# EAGLE design IVSTAGEV3 (EAGLE 5.07)
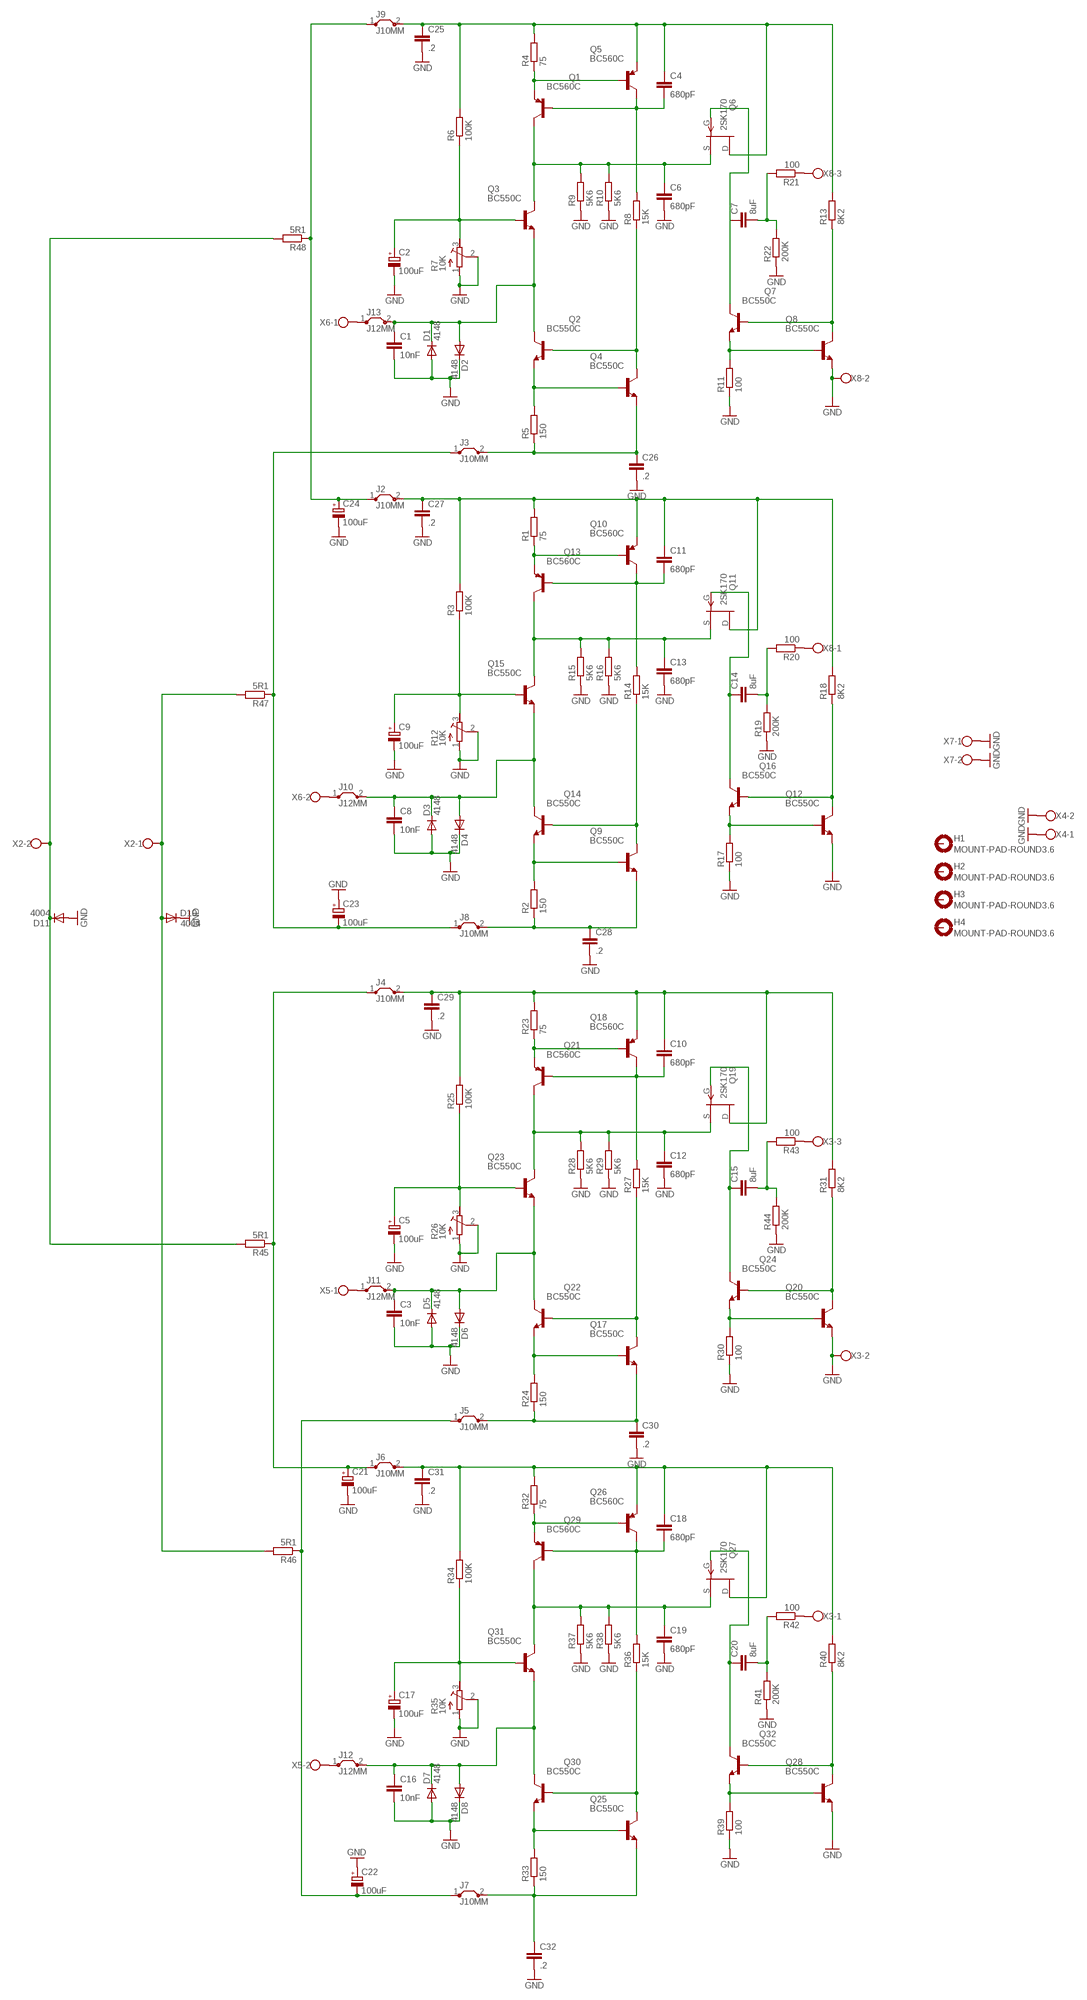
[diagram p0: schematic, sheet 1]

## Parts
C1  10nF  C-EU050-055X075  [C050-055X075]
C2  100uF  CPOL-EUE5-10.5  [E5-10,5]
C3  10nF  C-EU050-055X075  [C050-055X075]
C4  680pF  C-EU050-055X075  [C050-055X075]
C5  100uF  CPOL-EUE5-10.5  [E5-10,5]
C6  680pF  C-EU050-055X075  [C050-055X075]
C7  8uF  C-EU275-173X316  [C275-173X316]
C8  10nF  C-EU050-055X075  [C050-055X075]
C9  100uF  CPOL-EUE5-10.5  [E5-10,5]
C10  680pF  C-EU050-055X075  [C050-055X075]
C11  680pF  C-EU050-055X075  [C050-055X075]
C12  680pF  C-EU050-055X075  [C050-055X075]
C13  680pF  C-EU050-055X075  [C050-055X075]
C14  8uF  C-EU275-173X316  [C275-173X316]
C15  8uF  C-EU275-173X316  [C275-173X316]
C16  10nF  C-EU050-055X075  [C050-055X075]
C17  100uF  CPOL-EUE5-10.5  [E5-10,5]
C18  680pF  C-EU050-055X075  [C050-055X075]
C19  680pF  C-EU050-055X075  [C050-055X075]
C20  8uF  C-EU275-173X316  [C275-173X316]
C21  100uF  CPOL-EUE5-10.5  [E5-10,5]
C22  100uF  CPOL-EUE5-10.5  [E5-10,5]
C23  100uF  CPOL-EUE5-10.5  [E5-10,5]
C24  100uF  CPOL-EUE5-10.5  [E5-10,5]
C25  .2  C-EUC1210K  [C1210K]
C26  .2  C-EUC1210K  [C1210K]
C27  .2  C-EUC1210K  [C1210K]
C28  .2  C-EUC1210K  [C1210K]
C29  .2  C-EUC1210K  [C1210K]
C30  .2  C-EUC1210K  [C1210K]
C31  .2  C-EUC1210K  [C1210K]
C32  .2  C-EUC1210K  [C1210K]
D1  4148  1N4148DO35-7  [DO35-7]
D2  4148  1N4148DO35-7  [DO35-7]
D3  4148  1N4148DO35-7  [DO35-7]
D4  4148  1N4148DO35-7  [DO35-7]
D5  4148  1N4148DO35-7  [DO35-7]
D6  4148  1N4148DO35-7  [DO35-7]
D7  4148  1N4148DO35-7  [DO35-7]
D8  4148  1N4148DO35-7  [DO35-7]
D10  4004  1N4148DO35-7  [DO35-7]
D11  4004  1N4148DO35-7  [DO35-7]
H1  MOUNT-PAD-ROUND3.6  [3,6-PAD]
H2  MOUNT-PAD-ROUND3.6  [3,6-PAD]
H3  MOUNT-PAD-ROUND3.6  [3,6-PAD]
H4  MOUNT-PAD-ROUND3.6  [3,6-PAD]
J2  J10MM  [10]
J3  J10MM  [10]
J4  J10MM  [10]
J5  J10MM  [10]
J6  J10MM  [10]
J7  J10MM  [10]
J8  J10MM  [10]
J9  J10MM  [10]
J10  J12MM  [12]
J11  J12MM  [12]
J12  J12MM  [12]
J13  J12MM  [12]
Q1  BC560C  BC556  [TO92-EBC]
Q2  BC550C  BC546A  [TO92-EBC]
Q3  BC550C  BC546A  [TO92-EBC]
Q4  BC550C  BC546A  [TO92-EBC]
Q5  BC560C  BC556  [TO92-EBC]
Q6  2SK170  2N5484  [TO92-]
Q7  BC550C  BC546A  [TO92-EBC]
Q8  BC550C  BC546A  [TO92-EBC]
Q9  BC550C  BC546A  [TO92-EBC]
Q10  BC560C  BC556  [TO92-EBC]
Q11  2SK170  2N5484  [TO92-]
Q12  BC550C  BC546A  [TO92-EBC]
Q13  BC560C  BC556  [TO92-EBC]
Q14  BC550C  BC546A  [TO92-EBC]
Q15  BC550C  BC546A  [TO92-EBC]
Q16  BC550C  BC546A  [TO92-EBC]
Q17  BC550C  BC546A  [TO92-EBC]
Q18  BC560C  BC556  [TO92-EBC]
Q19  2SK170  2N5484  [TO92-]
Q20  BC550C  BC546A  [TO92-EBC]
Q21  BC560C  BC556  [TO92-EBC]
Q22  BC550C  BC546A  [TO92-EBC]
Q23  BC550C  BC546A  [TO92-EBC]
Q24  BC550C  BC546A  [TO92-EBC]
Q25  BC550C  BC546A  [TO92-EBC]
Q26  BC560C  BC556  [TO92-EBC]
Q27  2SK170  2N5484  [TO92-]
Q28  BC550C  BC546A  [TO92-EBC]
Q29  BC560C  BC556  [TO92-EBC]
Q30  BC550C  BC546A  [TO92-EBC]
Q31  BC550C  BC546A  [TO92-EBC]
Q32  BC550C  BC546A  [TO92-EBC]
R1  75  R-EU_0204/7  [0204/7]
R2  150  R-EU_0204/7  [0204/7]
R3  100K  R-EU_0204/7  [0204/7]
R4  75  R-EU_0204/7  [0204/7]
R5  150  R-EU_0204/7  [0204/7]
R6  100K  R-EU_0204/7  [0204/7]
R7  10K  R-TRIMM3296W  [RTRIM3296W]
R8  15K  R-EU_0309/12  [0309/12]
R9  5K6  R-EU_0207/10  [0207/10]
R10  5K6  R-EU_0207/10  [0207/10]
R11  100  R-EU_0204/7  [0204/7]
R12  10K  R-TRIMM3296W  [RTRIM3296W]
R13  8K2  R-EU_0309/12  [0309/12]
R14  15K  R-EU_0309/12  [0309/12]
R15  5K6  R-EU_0207/10  [0207/10]
R16  5K6  R-EU_0207/10  [0207/10]
R17  100  R-EU_0204/7  [0204/7]
R18  8K2  R-EU_0309/12  [0309/12]
R19  200K  R-EU_0204/7  [0204/7]
R20  100  R-EU_0204/7  [0204/7]
R21  100  R-EU_0204/7  [0204/7]
R22  200K  R-EU_0204/7  [0204/7]
R23  75  R-EU_0204/7  [0204/7]
R24  150  R-EU_0204/7  [0204/7]
R25  100K  R-EU_0204/7  [0204/7]
R26  10K  R-TRIMM3296W  [RTRIM3296W]
R27  15K  R-EU_0309/12  [0309/12]
R28  5K6  R-EU_0207/10  [0207/10]
R29  5K6  R-EU_0207/10  [0207/10]
R30  100  R-EU_0204/7  [0204/7]
R31  8K2  R-EU_0309/12  [0309/12]
R32  75  R-EU_0204/7  [0204/7]
R33  150  R-EU_0204/7  [0204/7]
R34  100K  R-EU_0204/7  [0204/7]
R35  10K  R-TRIMM3296W  [RTRIM3296W]
R36  15K  R-EU_0309/12  [0309/12]
R37  5K6  R-EU_0207/10  [0207/10]
R38  5K6  R-EU_0207/10  [0207/10]
R39  100  R-EU_0204/7  [0204/7]
R40  8K2  R-EU_0309/12  [0309/12]
R41  200K  R-EU_0204/7  [0204/7]
R42  100  R-EU_0204/7  [0204/7]
R43  100  R-EU_0204/7  [0204/7]
R44  200K  R-EU_0204/7  [0204/7]
R45  5R1  R-EU_0204/7  [0204/7]
R46  5R1  R-EU_0204/7  [0204/7]
R47  5R1  R-EU_0204/7  [0204/7]
R48  5R1  R-EU_0204/7  [0204/7]
X2  W237-02P  [W237-132]
X3  W237-3E  [W237-3E]
X4  W237-02P  [W237-132]
X5  W237-02P  [W237-132]
X6  W237-02P  [W237-132]
X7  W237-02P  [W237-132]
X8  W237-3E  [W237-3E]

## Nets
GND: C1.2 C2.- C3.2 C5.- C6.2 C8.2 C9.- C12.2 C13.2 C16.2 C17.- C19.2 C21.- C22.+ C23.+ C24.- C25.2 C26.2 C27.2 C28.2 C29.2 C30.2 C31.2 C32.2 D1.A D2.C D3.A D4.C D5.A D6.C D7.A D8.C D10.C D11.A Q8.E Q12.E Q20.E Q28.E R7.1(E) R7.2(S) R9.1 R10.1 R11.1 R12.1(E) R12.2(S) R15.1 R16.1 R17.1 R19.1 R22.1 R26.1(E) R26.2(S) R28.1 R29.1 R30.1 R35.1(E) R35.2(S) R37.1 R38.1 R39.1 R41.1 R44.1 X3.2 X4.1 X4.2 X7.1 X7.2 X8.2
N$1: C6.1 Q1.C Q3.C Q6.2(S) R9.2 R10.2
N$2: C1.1 D1.C D2.A J13.2 Q2.C Q3.E
N$3: C2.+ Q3.B R6.1 R7.3(A)
N$4: C13.1 Q11.2(S) Q13.C Q15.C R15.2 R16.2
N$5: C8.1 D3.C D4.A J10.2 Q14.C Q15.E
N$6: Q1.E Q5.B R4.1
N$7: Q2.E Q4.B R5.2
N$8: Q2.B Q4.C R8.1
N$9: C4.2 Q1.B Q5.C R8.2
N$10: C26.1 J3.2 Q4.E R5.1
N$11: C4.1 C25.1 J9.2 Q5.E Q6.3(D) R4.2 R6.2 R13.2
N$12: C9.+ Q15.B R3.1 R12.3(A)
N$13: C7.1 Q6.1(G) Q7.C
N$14: Q7.E Q8.B R11.2
N$15: Q10.B Q13.E R1.1
N$16: Q7.B Q8.C R13.1
N$17: Q9.B Q14.E R2.2
N$18: Q9.C Q14.B R14.1
N$19: C11.2 Q10.C Q13.B R14.2
N$20: C28.1 J8.2 Q9.E R2.1
N$21: C11.1 C27.1 J2.2 Q10.E Q11.3(D) R1.2 R3.2 R18.2
N$22: C14.1 Q11.1(G) Q16.C
N$23: Q12.B Q16.E R17.2
N$24: Q12.C Q16.B R18.1
N$25: C14.2 R19.2 R20.2
N$26: C7.2 R21.2 R22.2
N$27: R21.1 X8.3
N$28: R20.1 X8.1
N$29: C12.1 Q19.2(S) Q21.C Q23.C R28.2 R29.2
N$30: C3.1 D5.C D6.A J11.2 Q22.C Q23.E
N$31: C5.+ Q23.B R25.1 R26.3(A)
N$32: Q18.B Q21.E R23.1
N$33: Q17.B Q22.E R24.2
N$34: Q17.C Q22.B R27.1
N$35: C10.2 Q18.C Q21.B R27.2
N$36: C30.1 J5.2 Q17.E R24.1
N$37: C10.1 C29.1 J4.2 Q18.E Q19.3(D) R23.2 R25.2 R31.2
N$38: C15.1 Q19.1(G) Q24.C
N$39: Q20.B Q24.E R30.2
N$40: Q20.C Q24.B R31.1
N$41: C19.1 Q27.2(S) Q29.C Q31.C R37.2 R38.2
N$42: C16.1 D7.C D8.A J12.2 Q30.C Q31.E
N$43: C17.+ Q31.B R34.1 R35.3(A)
N$44: Q26.B Q29.E R32.1
N$45: Q25.B Q30.E R33.2
N$46: Q25.C Q30.B R36.1
N$47: C18.2 Q26.C Q29.B R36.2
N$48: C32.1 J7.2 Q25.E R33.1
N$49: C18.1 C31.1 J6.2 Q26.E Q27.3(D) R32.2 R34.2 R40.2
N$50: C20.1 Q27.1(G) Q32.C
N$51: Q28.B Q32.E R39.2
N$52: Q28.C Q32.B R40.1
N$53: C20.2 R41.2 R42.2
N$54: C15.2 R43.2 R44.2
N$55: R43.1 X3.3
N$56: R42.1 X3.1
N$57: C24.+ J2.1 J9.1 R48.1
N$58: C23.- J3.1 J8.1 R47.1
N$59: C21.+ J4.1 J6.1 R45.1
N$60: J12.1 X5.2
N$61: J11.1 X5.1
N$62: J10.1 X6.2
N$63: J13.1 X6.1
N$64: C22.- J5.1 J7.1 R46.1
N$65: D11.C R45.2 R48.2 X2.2
N$66: D10.A R46.2 R47.2 X2.1
Unconnected: H1.B3,6(MOUNT) H2.B3,6(MOUNT) H3.B3,6(MOUNT) H4.B3,6(MOUNT)

## Library data of the parts
C1 C3 C4 C6-C8 C10-C16 C18-C20 C25-C32 = resistor:C-EU: CAPACITOR, European symbol
C2 C5 C9 C17 C21-C24 = resistor:CPOL-EU: POLARIZED CAPACITOR, European symbol
D1-D8 D10 D11 = diode:1N4148: DIODE high speed (Philips)
H1-H4 = holes:MOUNT-PAD-ROUND: MOUNTING PAD, round
J2-J13 = jumper:J: Bridge
Q1 Q5 Q10 Q13 Q18 Q21 Q26 Q29 = transistor-pnp:BC556*: PNP Transistror
Q2-Q4 Q7-Q9 Q12 Q14-Q17 Q20 Q22-Q25 Q28 Q30-Q32 = transistor-npn:BC546*: NPN Transistor
Q6 Q11 Q19 Q27 = transistor-fet:?548*: N-Channel JFETs Source: VISHAY 2N5484.pdf Compatible: TO92 2N5245 J304 J305 U310 J308 J309 J310 TO72 2N4416 2N4416A 2N3823 2N4351 3N169 3N170 3N171 MFE3002 TO18 2N3796 2N3797 MFE825 Source: Motorola European Master Guide Pacge 3-59
R1-R6 R8-R11 R13-R25 R27-R34 R36-R48 = resistor:R-EU_: RESISTOR, European symbol
R7 R12 R26 R35 = resistor:R-TRIMM: Trimm resistor
X2 X4-X7 = con-wago-508:W237-02P: WAGO SREW CLAMP
X3 X8 = con-wago-508:W237-3E: WAGO SREW CLAMP

## Board
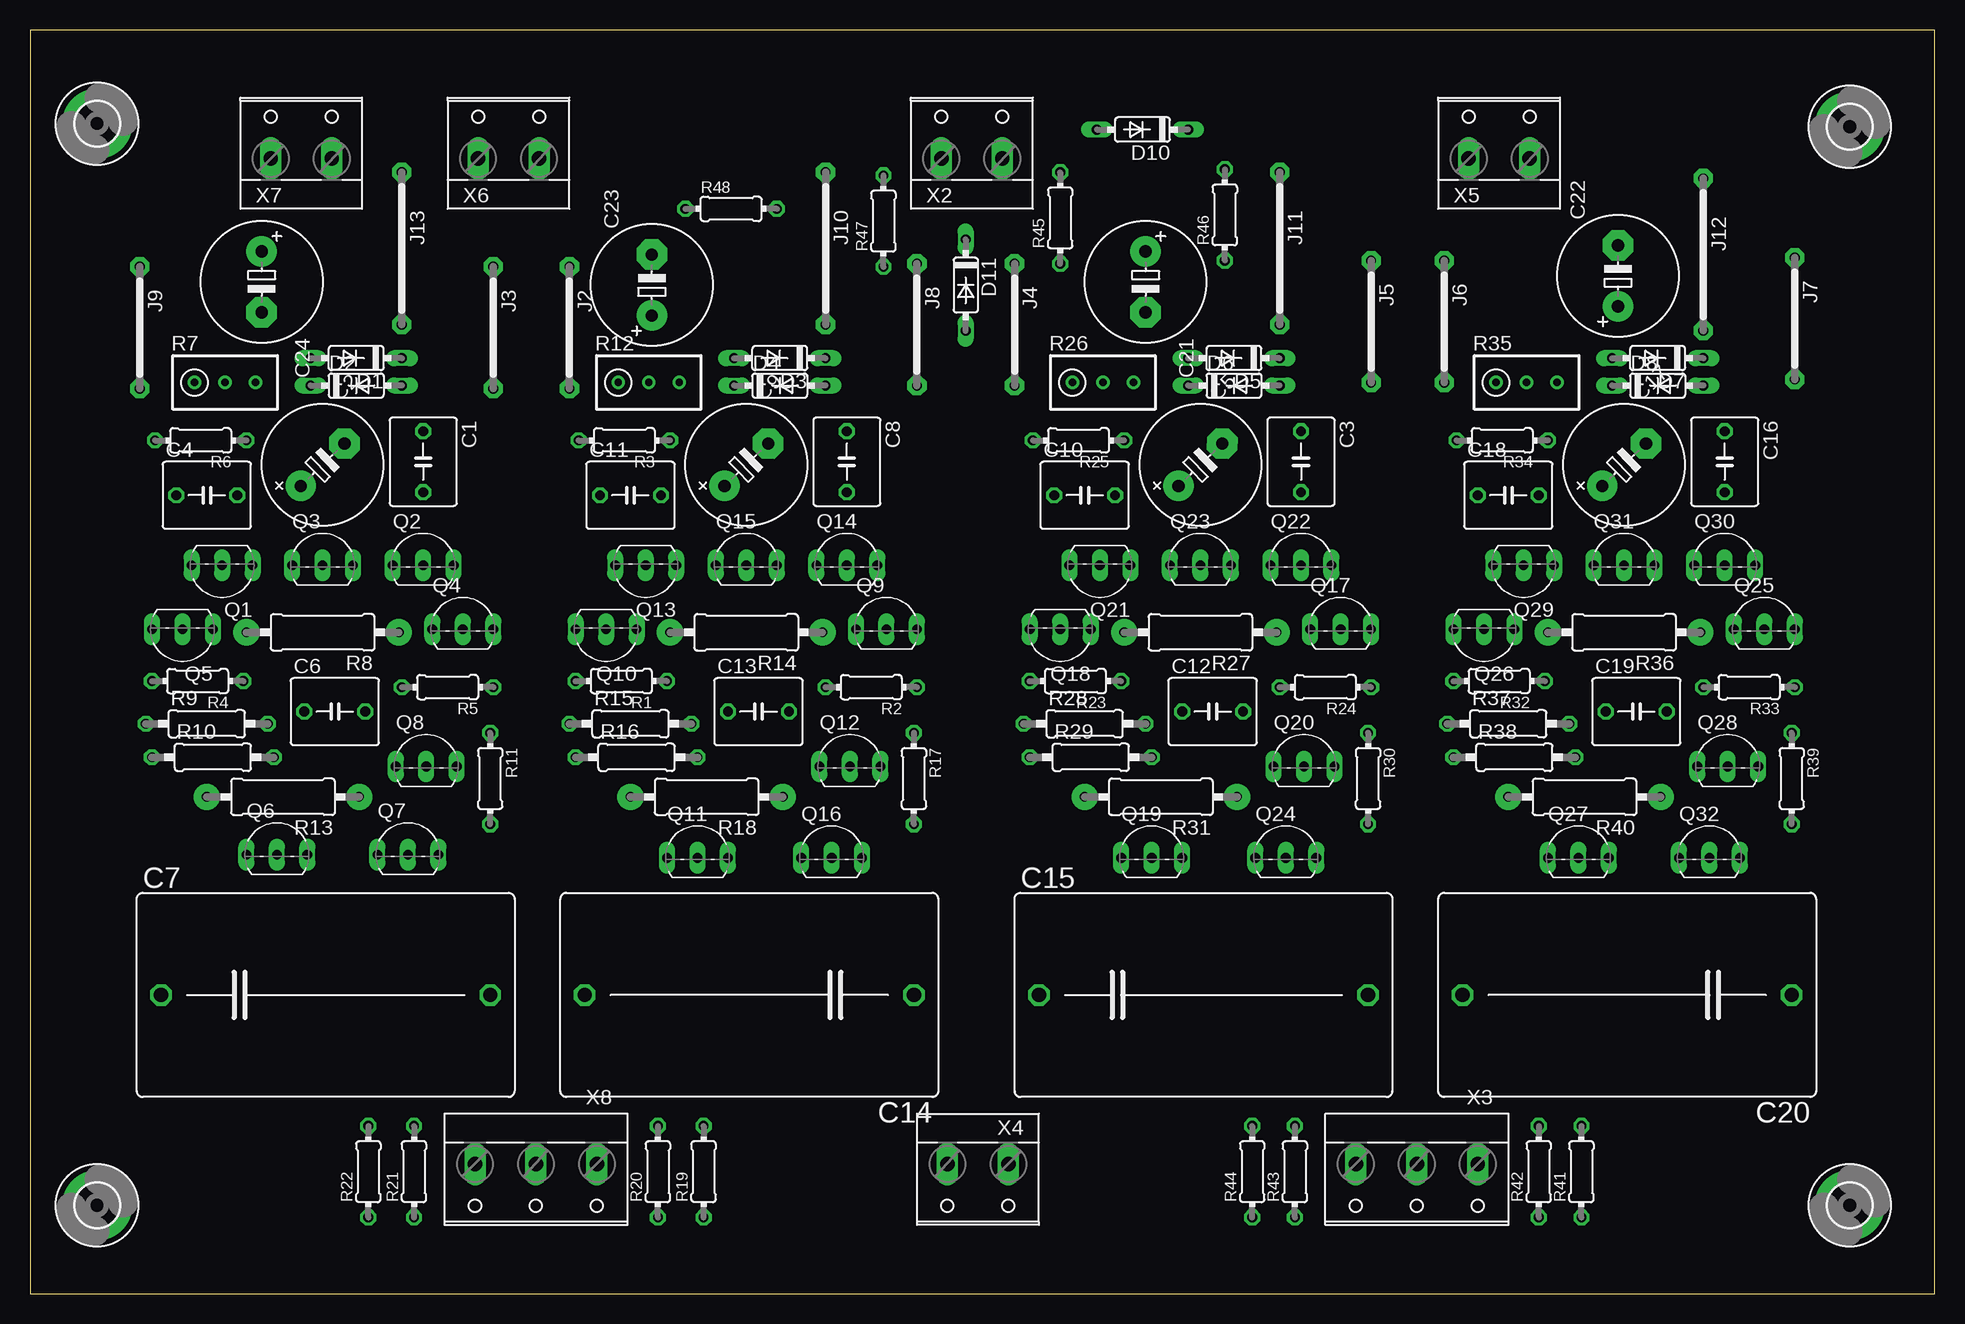
[diagram p1: board, top side]
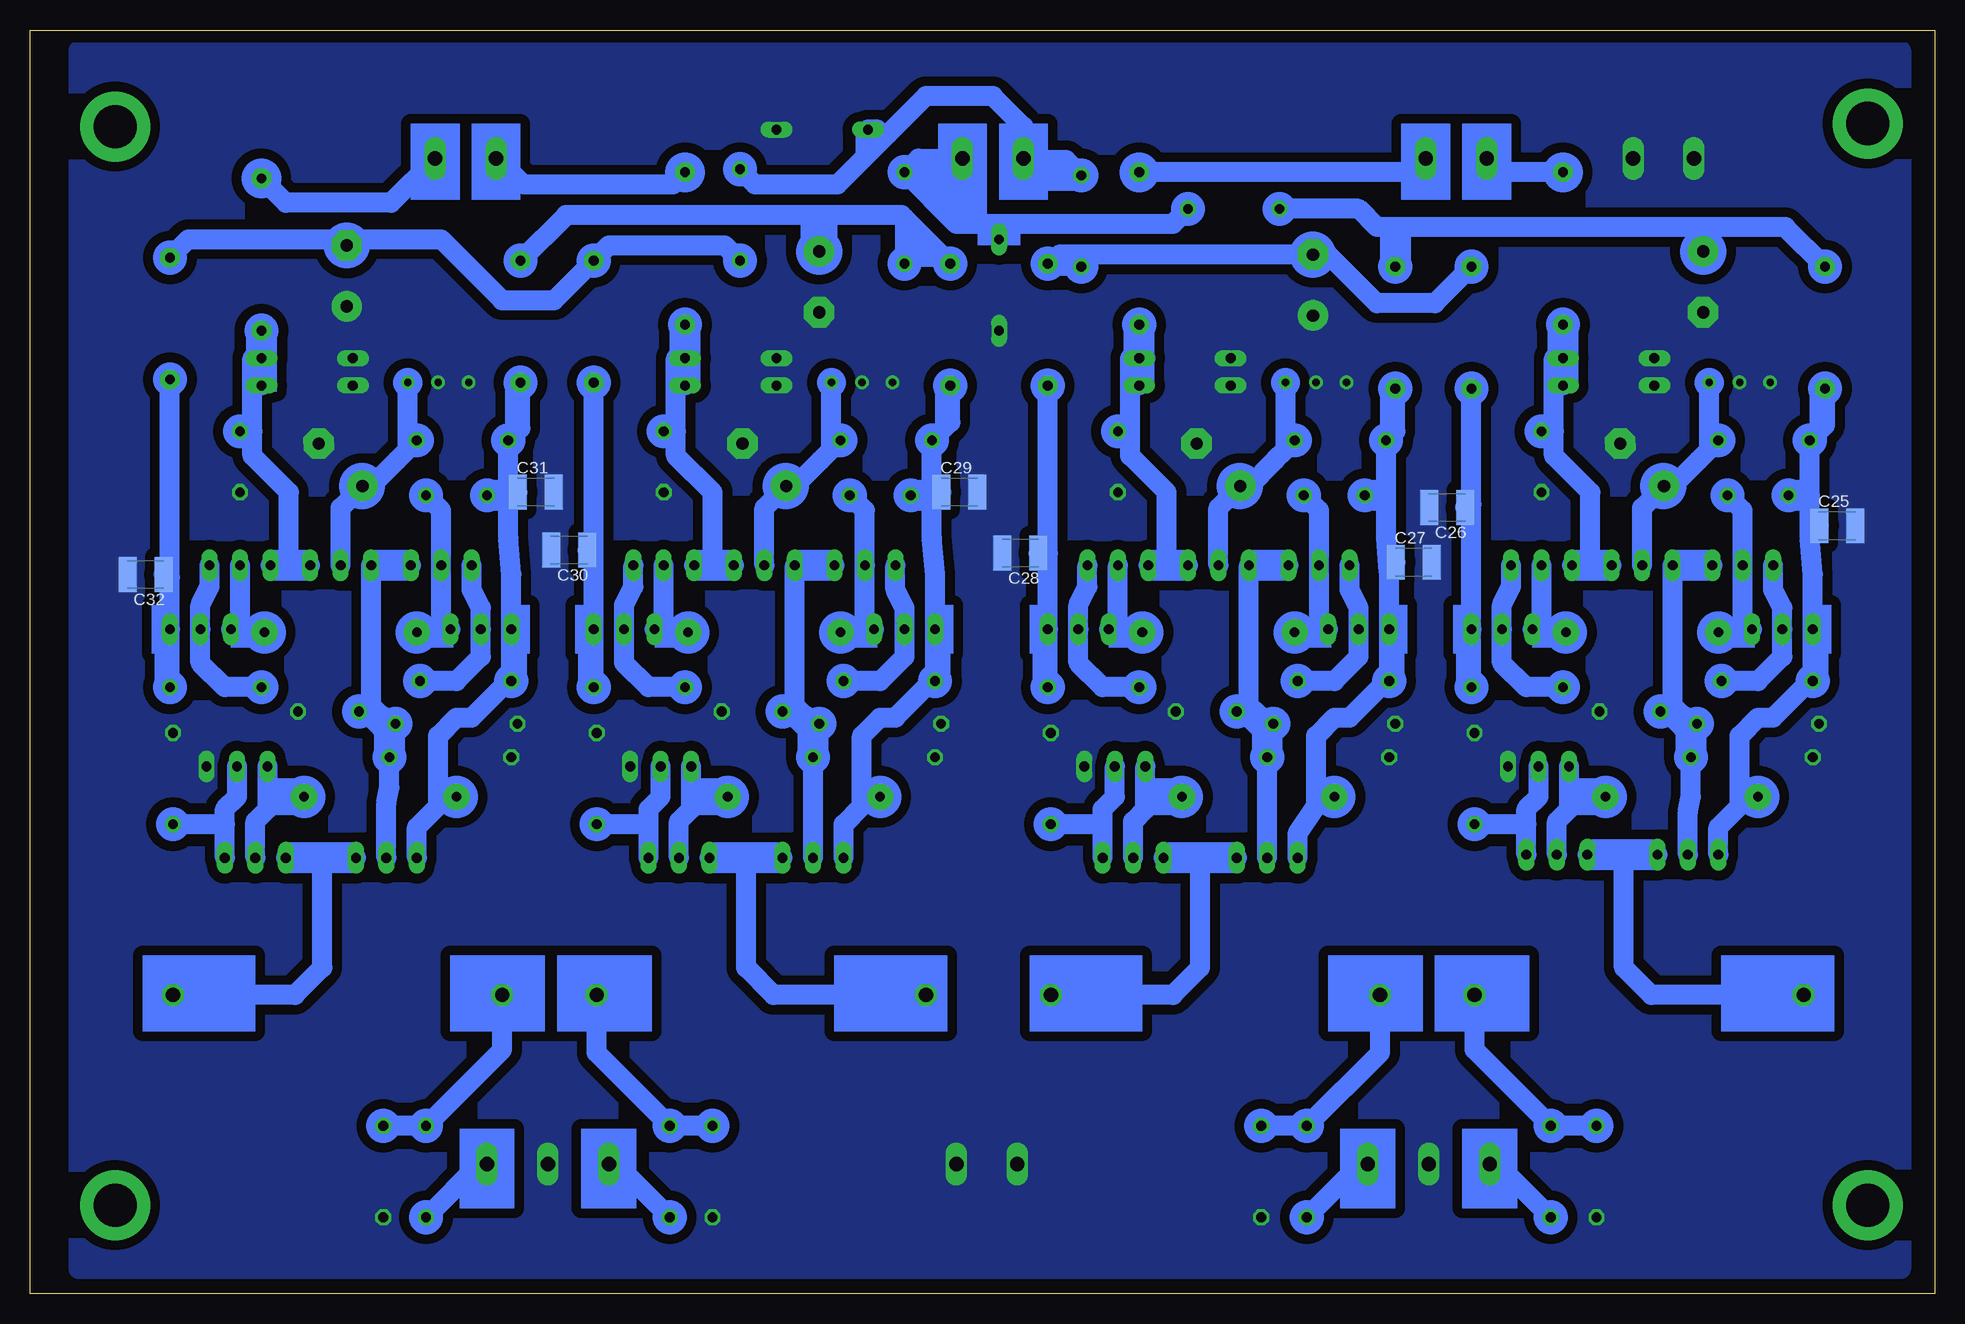
[diagram p2: board, bottom side, seen from below]

Size 158.73 x 105.33 mm. Coordinates in mm from the lower left corner, seen from the top.
Outline: 0,0 158.73,0 158.73,105.33 0,105.33 0,0
Copper layers (1*16): Top 0.035mm / dielectric 1.5mm / Bottom 0.035mm
Design rules "default *": minimum track width 10mil, minimum drill 24mil, track to track 8mil, track to pad 8mil, pad to pad 8mil, via to via 8mil, smd to smd 8mil, copper to edge 40mil, drill to drill 8mil, minimum pad ring 10mil, minimum via ring 8mil, stop-mask expansion 4mil, vias tented up to drill 0mil, thermal gap 10mil

### Footprints (pad centres in the part's own frame; a part is rotated, then mirrored left to right if it is on the bottom)
C050-055X075 = drill 0.813 octagon: 1 -2.54,0; 2 2.54,0
E5-10,5 = drill 1.016 pad 2.54 round: + -2.54,0 | drill 1.016 pad 2.54 octagon: - 2.54,0
C275-173X316 = drill 1.194 octagon: 1 -13.716,0; 2 13.716,0
C1210K = smd 1.5 x 2.9: 1 -1.5,0; 2 1.5,0
DO35-7 = drill 0.813 long: A 3.81,0; C -3.81,0
3,6-PAD = drill 3.6 pad 5.842 round: B3,6 0,0
10 = drill 0.813 pad 1.6 octagon: 1 -5.08,0; 2 5.08,0
12 = drill 0.813 pad 1.6 octagon: 1 -6.35,0; 2 6.35,0
TO92-EBC = drill 0.813 long: B 0,-1.27; C -2.54,-1.27; E 2.54,-1.27
TO92- = drill 0.813 long: 1 2.54,0; 2 0,0; 3 -2.54,0
0204/7 = drill 0.813 octagon: 1 -3.81,0; 2 3.81,0
RTRIM3296W = drill 0.61 round: 1 0,-2.54; 2 0,0; 3 0,2.54
0309/12 = drill 0.8 pad 2.184 round: 1 -6.35,0; 2 6.35,0
0207/10 = drill 0.813 octagon: 1 -5.08,0; 2 5.08,0
W237-132 = drill 1.194 long: 1 -2.54,-0.635; 2 2.54,-0.635
W237-3E = drill 1.194 long: 1 -5.08,-0.635; 2 0,-0.635; 3 5.08,-0.635

### Placement (x,y rotation side)
C1  32.77,69.34 270 top
C2  24.38,69.09 44.2 top
C3  105.92,69.34 270 top
C4  14.73,66.55 0 top
C5  97.54,69.09 44.2 top
C6  25.4,48.51 0 top
C7  24.64,24.89 0 top
C8  68.07,69.34 270 top
C9  59.69,69.09 44.2 top
C10  87.88,66.55 0 top
C11  50.04,66.55 0 top
C12  98.55,48.51 0 top
C13  60.71,48.51 0 top
C14  59.94,24.89 180 top
C15  97.79,24.89 0 top
C16  141.22,69.34 270 top
C17  132.84,69.09 44.2 top
C18  123.19,66.55 0 top
C19  133.86,48.51 0 top
C20  133.1,24.89 180 top
C21  92.96,84.33 270 top
C22  132.33,84.84 90 top
C23  51.82,84.07 90 top
C24  19.3,84.33 270 top
C25  8.13,64.01 0 bottom
C26  40.64,65.53 180 bottom
C27  43.43,60.96 0 bottom
C28  76.2,61.72 180 bottom
C29  81.28,66.8 0 bottom
C30  113.79,61.98 180 bottom
C31  116.59,66.8 0 bottom
C32  149.1,59.94 180 bottom
D1  27.18,77.98 180 top
D2  27.18,75.69 0 top
D3  62.48,77.98 180 top
D4  62.48,75.69 0 top
D5  100.33,77.98 180 top
D6  100.33,75.69 0 top
D7  135.64,77.98 180 top
D8  135.64,75.69 0 top
D10  92.71,97.03 180 top
D11  77.98,84.07 270 top
H1  5.59,7.37 0 top
H2  151.64,7.37 0 top
H3  5.59,97.54 0 top
H4  151.64,97.28 0 top
J2  44.96,80.52 270 top
J3  38.61,80.52 270 top
J4  82.04,80.77 270 top
J5  111.76,81.03 270 top
J6  117.86,81.03 270 top
J7  147.07,81.28 270 top
J8  73.91,80.77 270 top
J9  9.14,80.52 270 top
J10  66.29,87.12 270 top
J11  104.14,87.12 270 top
J12  139.45,86.61 270 top
J13  30.99,87.12 270 top
Q1  16,59.44 180 top
Q2  32.77,61.98 0 top
Q3  24.38,61.98 0 top
Q4  36.07,56.64 0 top
Q5  12.7,54.1 180 top
Q6  20.57,36.58 0 top
Q7  31.5,37.85 0 top
Q8  33.02,45.21 0 top
Q9  71.37,56.64 0 top
Q10  48.01,54.1 180 top
Q11  55.63,36.32 0 top
Q12  68.33,45.21 0 top
Q13  51.31,59.44 180 top
Q14  68.07,61.98 0 top
Q15  59.69,61.98 0 top
Q16  66.8,37.59 0 top
Q17  109.22,56.64 0 top
Q18  85.85,54.1 180 top
Q19  93.47,36.32 0 top
Q20  106.17,45.21 0 top
Q21  89.15,59.44 180 top
Q22  105.92,61.98 0 top
Q23  97.54,61.98 0 top
Q24  104.65,37.59 0 top
Q25  144.53,56.64 0 top
Q26  121.16,54.1 180 top
Q27  129.03,36.32 0 top
Q28  141.48,45.21 0 top
Q29  124.46,59.44 180 top
Q30  141.22,61.98 0 top
Q31  132.84,61.98 0 top
Q32  139.95,37.59 0 top
R1  49.28,51.05 180 top
R2  70.1,50.55 180 top
R3  49.53,71.12 180 top
R4  13.97,51.05 180 top
R5  34.8,50.55 180 top
R6  14.22,71.12 180 top
R7  16.26,75.95 270 top
R8  24.38,55.12 180 top
R9  14.73,47.5 0 top
R10  15.24,44.7 0 top
R11  38.35,42.93 270 top
R12  51.56,75.95 270 top
R13  21.08,41.4 180 top
R14  59.69,55.12 180 top
R15  50.04,47.5 0 top
R16  50.55,44.7 0 top
R17  73.66,42.93 270 top
R18  56.39,41.4 180 top
R19  56.13,10.16 90 top
R20  52.32,10.16 90 top
R21  32,10.16 90 top
R22  28.19,10.16 90 top
R23  87.12,51.05 180 top
R24  107.95,50.55 180 top
R25  87.38,71.12 180 top
R26  89.41,75.95 270 top
R27  97.54,55.12 180 top
R28  87.88,47.5 0 top
R29  88.39,44.7 0 top
R30  111.51,42.93 270 top
R31  94.23,41.4 180 top
R32  122.43,51.05 180 top
R33  143.26,50.55 180 top
R34  122.68,71.12 180 top
R35  124.71,75.95 270 top
R36  132.84,55.12 180 top
R37  123.19,47.5 0 top
R38  123.7,44.7 0 top
R39  146.81,42.93 270 top
R40  129.54,41.4 180 top
R41  129.29,10.16 90 top
R42  125.73,10.16 90 top
R43  105.41,10.16 90 top
R44  101.85,10.16 90 top
R45  85.85,89.66 90 top
R46  99.57,89.92 90 top
R47  71.12,89.41 90 top
R48  58.42,90.42 0 top
X2  78.49,95.25 0 top
X3  115.57,10.16 180 top
X4  78.99,10.16 180 top
X5  122.43,95.25 0 top
X6  39.88,95.25 0 top
X7  22.61,95.25 0 top
X8  42.16,10.16 180 top

### Tracks (layer width: path | path; a pad name or v marks a point on that pad's centre or on a via)
GND
  pour Bottom (isolate 0.813, no thermals): 2.79,103.63 2.79,2.03 154.69,2.03 154.69,103.63
N$1
  Bottom 1.676: Q1.C Q3.C 21.84,49.02 | 21.84,49.02 21.08,48.26 R9.2 R10.2 20.32,41.4 20.57,40.13 Q6.2 | 21.84,49.02 21.84,48.51 | 21.84,48.51 21.84,48.01 20.32,46.48 | 21.84,48.51 C6.1
N$2
  Bottom 1.676: Q3.E 28.7,60.71 | 28.7,60.71 Q2.C | 28.7,60.71 28.7,66.8 31.75,69.85 31.75,71.88 | 31.75,71.88 C1.1 | 31.75,71.88 31.75,75.69 | 31.75,75.69 31.75,77.98 D1.C | 31.75,75.69 D2.A | D1.C J13.2 | D1.C 30.99,76.96
N$3
  Bottom 1.676: 18.8,70.36 R6.1 | Q3.B 24.38,65.5 C2.+ 21.84,67.32 19.69,69.47 18.8,70.36 | 18.8,70.36 R7.3
N$4
  Bottom 1.676: Q13.C Q15.C 57.15,49.02 | 57.15,49.02 56.39,48.26 R15.2 R16.2 Q11.2 | 57.15,49.02 57.15,48.51 | 57.15,48.51 57.15,48.01 55.63,46.48 | 57.15,48.51 C13.1
N$5
  Bottom 1.676: Q15.E 64.01,60.71 | 64.01,60.71 Q14.C | 64.01,60.71 64.01,66.8 67.06,69.85 67.06,71.88 | 67.06,71.88 C8.1 | 67.06,71.88 67.06,75.69 | 67.06,75.69 67.06,77.98 D3.C | 67.06,75.69 D4.A | D3.C 65.79,77.98 | D3.C J10.2
N$6
  Bottom 1.676: Q1.E 13.46,58.67 12.7,57.15 Q5.B 12.7,53.09 14.73,51.05 R4.1
N$7
  Bottom 1.676: Q2.E 35.31,58.93 36.07,57.4 Q4.B 36.07,52.58 34.04,50.55 R5.2
N$8
  Bottom 1.676: R8.1 32.77,55.37 | 32.77,55.37 Q4.C | 32.77,55.37 Q2.B
N$9
  Bottom 1.676: Q5.C 16,55.37 | 16,55.37 R8.2 | 16,55.37 Q1.B 16,65.28 C4.2
N$10
  Bottom 1.676: R5.1 Q4.E 38.61,65.79 | 38.61,65.79 J3.2 | C26.1 38.89,65.79 38.61,65.79
N$11
  Bottom 1.676: 10.41,63.75 10.41,62.99 10.16,59.94 Q5.E R4.2 10.41,51.05 13.46,48.01 14.73,48.01 16.26,46.48 16.26,41.66 | 10.41,63.75 10.41,66.55 | 10.41,66.55 R6.2 9.14,72.39 J9.2 | 10.41,66.55 C4.1 | 16.26,41.66 R13.2 | 16.26,41.66 16.26,40.64 18.03,38.86 Q6.3 | C25.1 9.88,63.75 10.41,63.75
N$12
  Bottom 1.676: 54.1,70.36 R3.1 | Q15.B 59.69,65.5 C9.+ 57.14,67.32 54.99,69.47 54.1,70.36 | 54.1,70.36 R12.3
N$13
  Bottom 1.676: 25.91,36.58 Q7.C | 25.91,36.58 25.91,27.18 23.62,24.89 C7.1 | 25.91,36.58 Q6.1
N$14
  Bottom 1.676: Q8.B 33.02,41.4 34.04,40.39 34.04,39.12 | Q7.E 34.04,39.12 | 34.04,39.12 R11.2
N$15
  Bottom 1.676: Q13.E 48.77,58.67 48.01,57.15 Q10.B 48.01,53.09 50.04,51.05 R1.1
N$16
  Bottom 1.676: Q7.B 31.5,39.37 30.48,40.39 30.48,41.4 | 30.48,41.4 Q8.C | 30.48,41.4 R13.1
N$17
  Bottom 1.676: Q14.E 70.61,58.93 71.37,57.4 Q9.B 71.37,52.58 69.34,50.55 R2.2
N$18
  Bottom 1.676: R14.1 68.07,55.37 | 68.07,55.37 Q9.C | 68.07,55.37 Q14.B
N$19
  Bottom 1.676: Q10.C 51.31,55.37 | 51.31,55.37 R14.2 | 51.31,55.37 Q13.B 51.31,65.28 C11.2
N$20
  Bottom 1.676: R2.1 Q9.E 73.91,61.72 | 73.91,61.72 J8.2 | 73.91,61.72 C28.1
N$21
  Bottom 1.676: 45.53,60.66 45.47,59.94 Q10.E R1.2 45.72,51.05 48.77,48.01 50.04,48.01 51.56,46.48 51.56,41.66 | 45.53,60.66 45.72,62.99 45.72,66.55 | 45.72,66.55 R3.2 44.96,71.88 J2.2 | 45.72,66.55 C11.1 | 51.56,41.66 R18.2 | 51.56,41.66 51.56,40.64 53.09,38.35 Q11.3 | C27.1 45.23,60.66 45.53,60.66
N$22
  Bottom 1.676: 61.21,36.32 Q16.C | 61.21,36.32 61.21,27.18 63.5,24.89 C14.1 | 61.21,36.32 Q11.1
N$23
  Bottom 1.676: Q12.B 68.33,41.4 69.34,40.39 69.34,39.12 | Q16.E 69.34,39.12 | 69.34,39.12 R17.2
N$24
  Bottom 1.676: Q16.B 66.8,39.37 65.79,40.39 65.79,41.4 | 65.79,41.4 Q12.C | 65.79,41.4 R18.1
N$25
  Bottom 1.676: R19.2 R20.2 46.23,20.07 C14.2
N$26
  Bottom 1.676: R22.2 R21.2 38.35,20.32 C7.2 40.64,23.37
N$27
  Bottom 1.676: R21.1 36.45,10.79 X8.3
N$28
  Bottom 1.676: R20.1 47.88,10.79 X8.1
N$29
  Bottom 1.676: Q21.C Q23.C 95,49.02 | 95,49.02 94.23,48.26 R28.2 R29.2 Q19.2 | 95,49.02 95,48.51 | 95,48.51 95,48.01 93.47,46.48 | 95,48.51 C12.1
N$30
  Bottom 1.676: Q23.E 101.85,60.71 | 101.85,60.71 Q22.C | 101.85,60.71 101.85,66.8 104.9,69.85 104.9,71.88 | 104.9,71.88 C3.1 | 104.9,71.88 104.9,75.69 | 104.9,75.69 104.9,77.98 D5.C J11.2 | 104.9,75.69 D6.A
N$31
  Bottom 1.676: 91.95,70.36 R25.1 | Q23.B 97.54,65.5 C5.+ 94.99,67.32 92.84,69.47 91.95,70.36 | 91.95,70.36 R26.3
N$32
  Bottom 1.676: Q21.E 86.61,58.67 85.85,57.15 Q18.B 85.85,53.09 87.88,51.05 R23.1
N$33
  Bottom 1.676: Q22.E 108.46,58.93 109.22,57.4 Q17.B 109.22,52.58 107.19,50.55 R24.2
N$34
  Bottom 1.676: R27.1 105.92,55.37 | 105.92,55.37 Q17.C | 105.92,55.37 Q22.B
N$35
  Bottom 1.676: Q18.C 89.15,55.37 | 89.15,55.37 R27.2 | 89.15,55.37 Q21.B 89.15,65.28 C10.2
N$36
  Bottom 1.676: R24.1 Q17.E 111.76,61.72 | 111.76,61.72 J5.2 | C30.1 112.04,61.72 111.76,61.72
N$37
  Bottom 1.676: 83.57,66.55 83.57,62.99 83.31,59.94 Q18.E R23.2 83.57,51.05 86.61,48.01 87.88,48.01 89.41,46.48 89.41,41.66 | 83.57,66.55 83.57,66.8 | 83.57,66.8 R25.2 82.04,72.64 J4.2 | 83.57,66.55 C10.1 | 89.41,41.66 R31.2 | 89.41,41.66 89.41,40.64 90.93,39.12 Q19.3 | 83.57,66.8 C29.1
N$38
  Bottom 1.676: 99.06,36.32 Q24.C | 99.06,36.32 99.06,27.18 96.77,24.89 C15.1 | 99.06,36.32 Q19.1
N$39
  Bottom 1.676: Q20.B 106.17,41.4 107.19,40.39 107.19,39.12 | Q24.E 107.19,39.12 | 107.19,39.12 R30.2
N$40
  Bottom 1.676: Q24.B 104.65,39.37 103.63,40.39 103.63,41.4 | 103.63,41.4 Q20.C | 103.63,41.4 R31.1
N$41
  Bottom 1.676: Q29.C Q31.C 130.3,49.02 | 130.3,49.02 129.54,48.26 R37.2 R38.2 128.78,42.16 129.03,40.89 Q27.2 | 130.3,49.02 130.3,48.51 | 130.3,48.51 130.3,48.01 128.78,46.48 | 130.3,48.51 C19.1
N$42
  Bottom 1.676: Q31.E 137.16,60.71 | 137.16,60.71 Q30.C | 137.16,60.71 137.16,66.8 140.21,69.85 140.21,71.88 | 140.21,71.88 C16.1 | 140.21,71.88 140.21,75.69 | 140.21,75.69 140.21,77.98 D7.C | 140.21,75.69 D8.A | D7.C 138.94,77.98 | D7.C J12.2
N$43
  Bottom 1.676: 127.25,70.36 R34.1 | Q31.B 132.84,65.5 C17.+ 130.3,67.32 128.14,69.47 127.25,70.36 | 127.25,70.36 R35.3
N$44
  Bottom 1.676: Q29.E 121.92,58.67 121.16,57.15 Q26.B 121.16,53.09 123.19,51.05 R32.1
N$45
  Bottom 1.676: Q30.E 143.76,58.93 144.53,57.4 Q25.B 144.53,52.58 142.49,50.55 R33.2
N$46
  Bottom 1.676: R36.1 141.22,55.37 | 141.22,55.37 Q25.C | 141.22,55.37 Q30.B
N$47
  Bottom 1.676: Q26.C 124.46,55.37 | 124.46,55.37 R36.2 | 124.46,55.37 Q29.B 124.46,65.28 C18.2
N$48
  Bottom 1.676: R33.1 Q25.E 147.07,59.69 | 147.07,59.69 J7.2 | C32.1 147.34,59.69 147.07,59.69
N$49
  Bottom 1.676: 118.87,66.55 118.87,62.99 118.62,59.94 Q26.E R32.2 118.87,51.05 121.92,48.01 123.19,48.01 124.71,46.48 124.71,41.66 | 118.87,66.55 R34.2 117.86,72.14 J6.2 | 118.87,66.55 C18.1 | 124.71,41.66 R40.2 | 124.71,41.66 124.71,40.64 126.49,38.86 Q27.3 | C31.1 118.34,66.55 118.87,66.55
N$50
  Bottom 1.676: 134.37,36.32 Q32.C | 134.37,36.32 134.37,27.18 136.65,24.89 C20.1 | 134.37,36.32 Q27.1
N$51
  Bottom 1.676: Q28.B 141.48,41.4 142.49,40.39 142.49,39.12 | Q32.E 142.49,39.12 | 142.49,39.12 R39.2
N$52
  Bottom 1.676: Q32.B 139.95,39.37 138.94,40.39 138.94,41.4 | 138.94,41.4 Q28.C | 138.94,41.4 R40.1
N$53
  Bottom 1.676: C20.2 119.38,20.32 R42.2 R41.2
N$54
  Bottom 1.676: C15.2 111.51,20.07 R43.2 R44.2
N$55
  Bottom 1.676: X3.3 109.86,10.79 R43.1
N$56
  Bottom 1.676: X3.1 121.28,10.79 R42.1
N$57
  Bottom 1.676: J9.1 12.45,88.9 19.3,88.9 | 19.3,88.9 C24.+ | R48.1 48.01,90.42 46.48,88.9 44.96,88.9 | 19.3,88.9 44.96,88.9 | 44.96,88.9 J2.1
N$58
  Bottom 1.676: J3.1 41.66,82.55 46.48,82.55 50.55,86.61 C23.- 71.12,86.61 | 71.12,86.61 72.9,86.61 73.66,85.85 J8.1 | 71.12,86.61 R47.1
N$59
  Bottom 1.676: J4.1 85.85,89.66 | 85.85,89.66 86.11,89.92 92.96,89.92 | 92.96,89.92 114.05,89.92 J6.1 | 92.96,89.92 C21.+ | 85.85,89.66 R45.1
N$60
  Bottom 1.676: X5.2 128.65,90.93 137.41,90.93 J12.1
N$61
  Bottom 1.676: J11.1 105.16,92.46 117.6,92.46 119.76,94.62 X5.1
N$62
  Bottom 1.676: X6.2 42.67,94.36 42.67,93.22 42.93,93.47 J10.1
N$63
  Bottom 1.676: J13.1 37.08,93.47 37.34,93.73 X6.1
N$64
  Bottom 1.676: 132.33,87.88 145.54,87.88 J7.1 | 132.33,87.88 124.46,87.88 119.38,82.8 115.06,82.8 J5.1 110.49,87.38 100.84,87.38 R46.1 | 132.33,87.88 C22.-
N$65
  Bottom 1.676: X2.2 84.71,94.62 R45.2 81.53,89.15 77.98,89.15 | R48.2 63.5,89.15 77.98,89.15 | 77.98,89.15 D11.C
N$66
  Bottom 1.676: R47.2 72.39,94.49 75.82,94.49 X2.1 75.95,97.28 78.49,99.82 84.07,99.82 87.25,96.65 | 87.25,96.65 91.44,92.46 98.3,92.46 R46.2 | D10.A 88.14,97.03 87.76,96.65 87.25,96.65
(copper drawn outside any net)
  shapes: Bottom area x111, Bottom circle x132